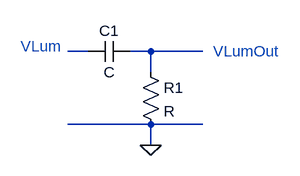
[diagram p0: schematic passe haut.asc]
passe haut.asc, the LTspice schematic file:
Version 4.1
SHEET 1 880 680
WIRE 128 112 96 112
WIRE 224 112 192 112
WIRE 304 112 224 112
WIRE 224 144 224 112
WIRE 224 224 96 224
WIRE 304 224 224 224
WIRE 224 256 224 224
FLAG 224 256 0
SYMBOL cap 192 96 R90
WINDOW 0 0 32 VBottom 2
WINDOW 3 32 32 VTop 2
SYMATTR InstName C1
SYMBOL res 208 128 R0
SYMATTR InstName R1
TEXT 24 104 Left 2 ;VLum
TEXT 320 112 Left 2 ;VLumOut

The netlist it stands for:
* passe haut.asc
C1 N002 N001 C
R1 N002 0 R
* VLum
* VLumOut
.backanno
.end